# EasyEDA schematic PuzzleBox.json
TITLE: Keypad Controller; REV: 1.0; Date: 2023-01-27; Sheet: 1/1; Drawn By: Robert Jeff Mitchell; Company: Mitchell Entertainment
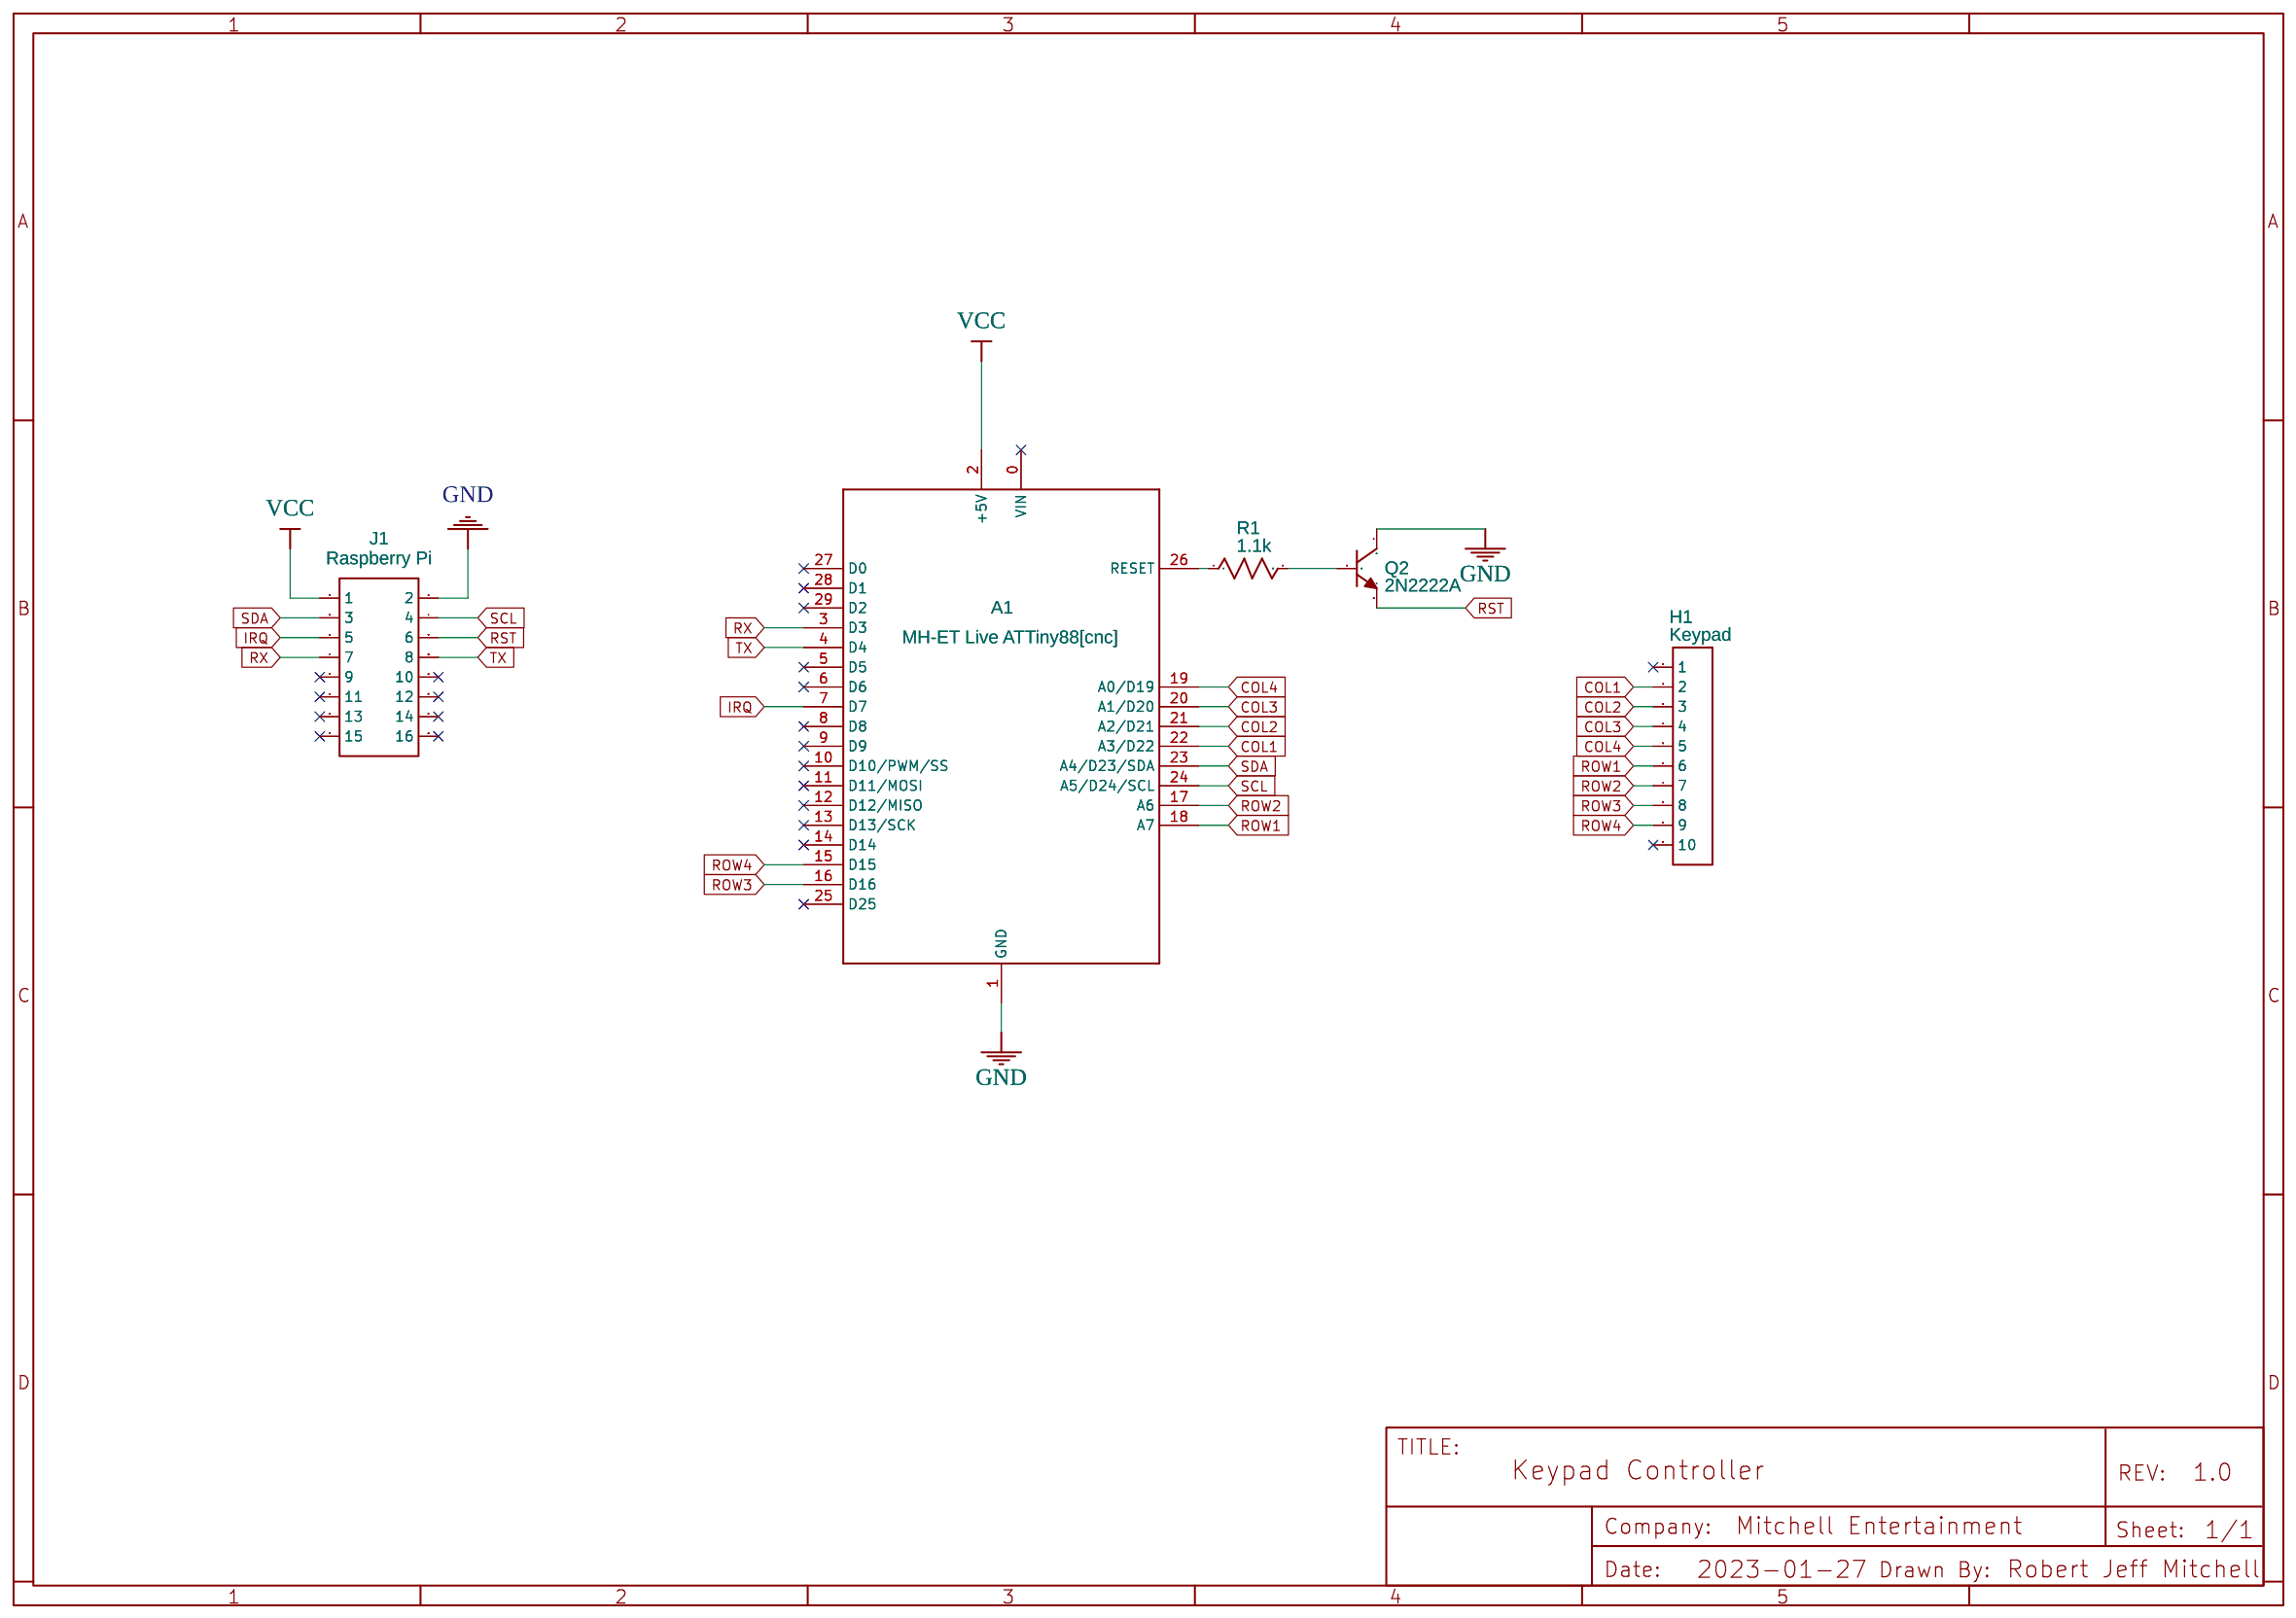
[diagram p0: schematic sheet]

## Parts
A1  MH-ET Live ATTiny88[cnc]  [MH-EH LIVE ATTINY88[CNC]]
H1  Keypad  [HDR-F-2.54_1X10]
J1  Raspberry Pi  [HDR-M-2.54_2X8]
Q2  2N2222A  [NPN-2N2222A]
R1  1.1k  [R_AXIAL-0.4]

## Library data of the parts
A1 = MH-ET Live ATTiny88[cnc]: link: http://www.getmicros.net/mh-et-live-tiny88-an-arduino-compatible-development-board.php; Contributor: Audrius Lukauskas
H1 = HDR-F-2.54_1x10: Supplier Part: C35445; Supplier: LCSC; Contributor: LCEDA_Lib
J1 = HDR-M-2.54_2x8: Supplier Part: C68234; Supplier: LCSC; Contributor: LCEDA_Lib
Q2 = 2N2222A: Supplier: LCSC; Supplier Part: C358533; Manufacturer: Mauser; Contributor: lcrcastell
R1 = R_AXIAL-0.4_US: Contributor: LCEDA_Lib

## Nets
GND: A1.1(GND) J1.2 Q2.1(C)
VCC: A1.2(+5V) J1.1
COL1: A1.22(A3/D22) H1.2
COL2: A1.21(A2/D21) H1.3
COL3: A1.20(A1/D20) H1.4
COL4: A1.19(A0/D19) H1.5
IRQ: A1.7(D7) J1.5
ROW1: A1.18(A7) H1.6
ROW2: A1.17(A6) H1.7
ROW3: A1.16(D16) H1.8
ROW4: A1.15(D15) H1.9
RST: J1.6 Q2.3(E)
RX: A1.3(D3) J1.7
SCL: A1.24(A5/D24/SCL) J1.4
SDA: A1.23(A4/D23/SDA) J1.3
TX: A1.4(D4) J1.8
Net-(A1-26): A1.26(RESET) R1.1
Net-(Q2-2): Q2.2(B) R1.2

Not connected (* = marked no-connect by the designer): A1 0(VIN)* 5(D5)* 6(D6)* 8(D8)* 9(D9)* 10(D10/PWM/SS)* 11(D11/MOSI)* 12(D12/MISO)* 13(D13/SCK)* 14(D14)* 25(D25)* 27(D0)* 28(D1)* 29(D2)*; H1 1* 10*; J1 9* 10* 11* 12* 13* 14* 15* 16*
